# EAGLE schematic PIR1 (EAGLE 9.7.0)
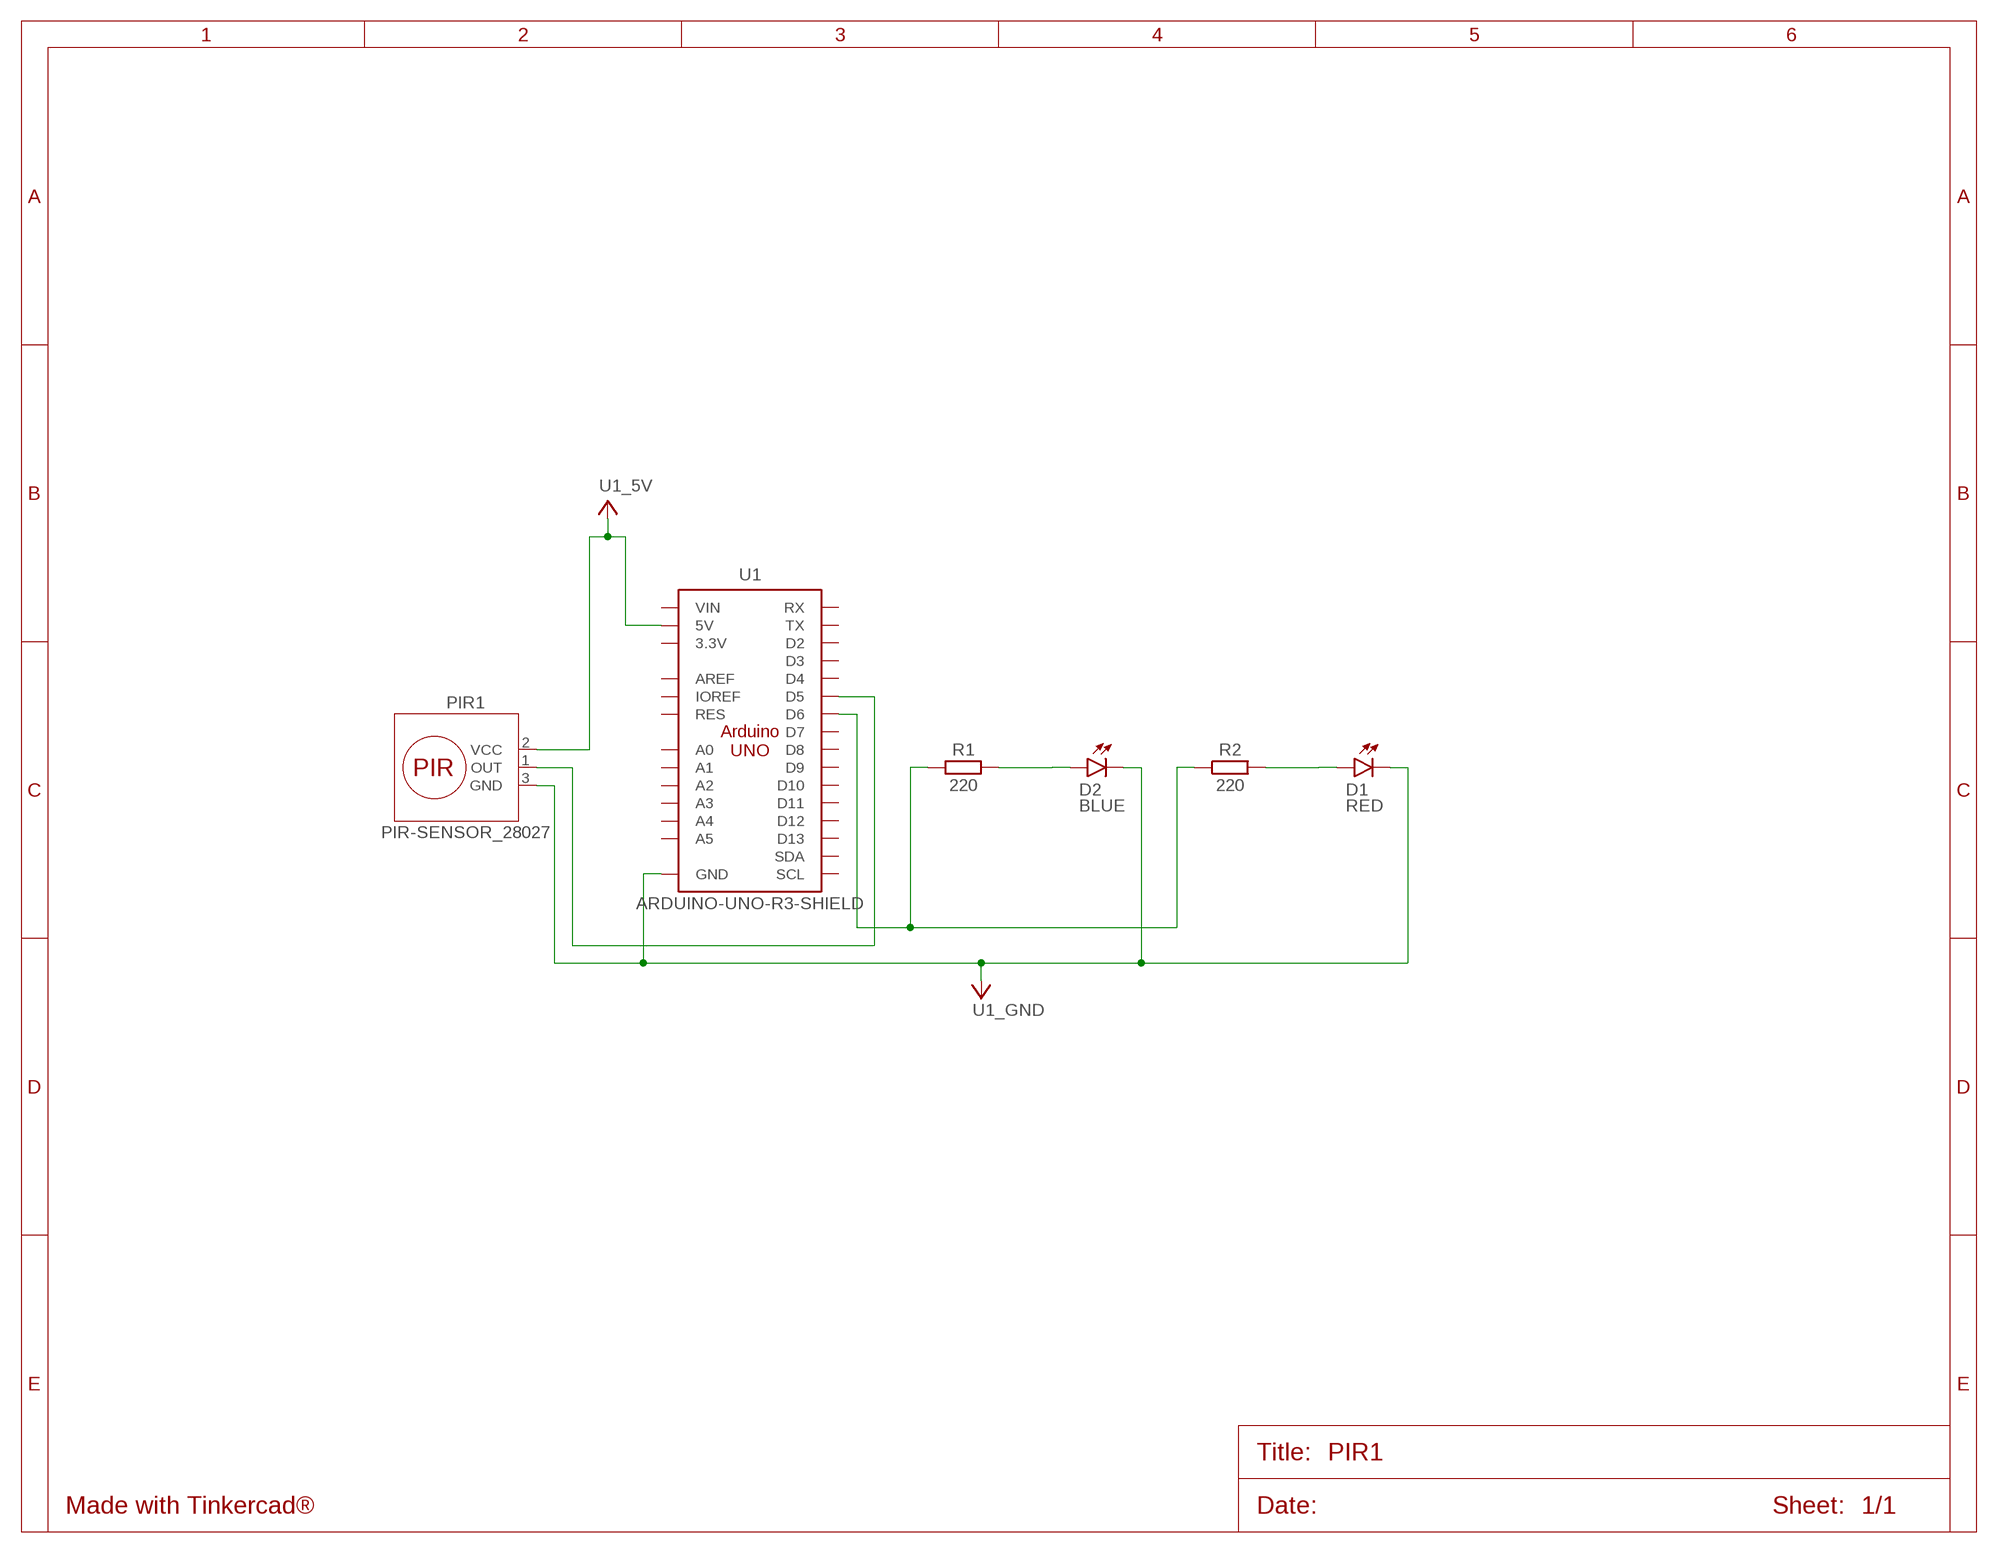
[diagram p0: schematic, sheet 1]

## Parts
D1  RED  LED_RADIAL_RED  [LEDRD254W60D565H860B]
D2  BLUE  LED_RADIAL_BLUE  [LEDRD254W60D565H860B_B]
PIR1  PIR-SENSOR_28027  [28027]
R1  220  RESISTOR_AXIAL-10.16MM-PITCH  [RESAD1016W63L850D250B]
R2  220  RESISTOR_AXIAL-10.16MM-PITCH  [RESAD1016W63L850D250B]
U1  ARDUINO-UNO-R3-SHIELD  [ARDUINO-UNO-R3-SHIELD]

## Nets
D1_A: D1.1(A) R2.2
D2_A: D2.1(A) R1.2
U1_5V: PIR1.2(VCC) U1.5V
U1_D5: PIR1.1(OUT) U1.D5
U1_D6: R1.1 R2.1 U1.D6
U1_GND: D1.2(C) D2.2(C) PIR1.3(GND) U1.GND@0(GND) U1.GND@1(GND) U1.GND@2(GND)
Unconnected: U1.3.3V U1.A0 U1.A1 U1.A2 U1.A3 U1.A4 U1.A5 U1.AREF U1.D2 U1.D3 U1.D4 U1.D7 U1.D8 U1.D9 U1.D10 U1.D11 U1.D12 U1.D13 U1.IOREF U1.RES U1.RX U1.SCL U1.SDA U1.TX U1.VIN

## Library data of the parts
D1 = Tinkercad:LED_RADIAL: LED - Generic; CATEGORY: Opto-Electronic; SUB-CATEGORY: LED; VALUE: LED_RED
D2 = Tinkercad:LED_RADIAL: LED - Generic; CATEGORY: Opto-Electronic; SUB-CATEGORY: LED; VALUE: LED_BLUE
PIR1 = Tinkercad:PIR-SENSOR
R1 R2 = Tinkercad:RESISTOR: Resistor Fixed - Generic
U1 = Tinkercad:ARDUINO-UNO-R3-SHIELD